# EAGLE design 8 Cell Balancing Module (EAGLE 5.12)
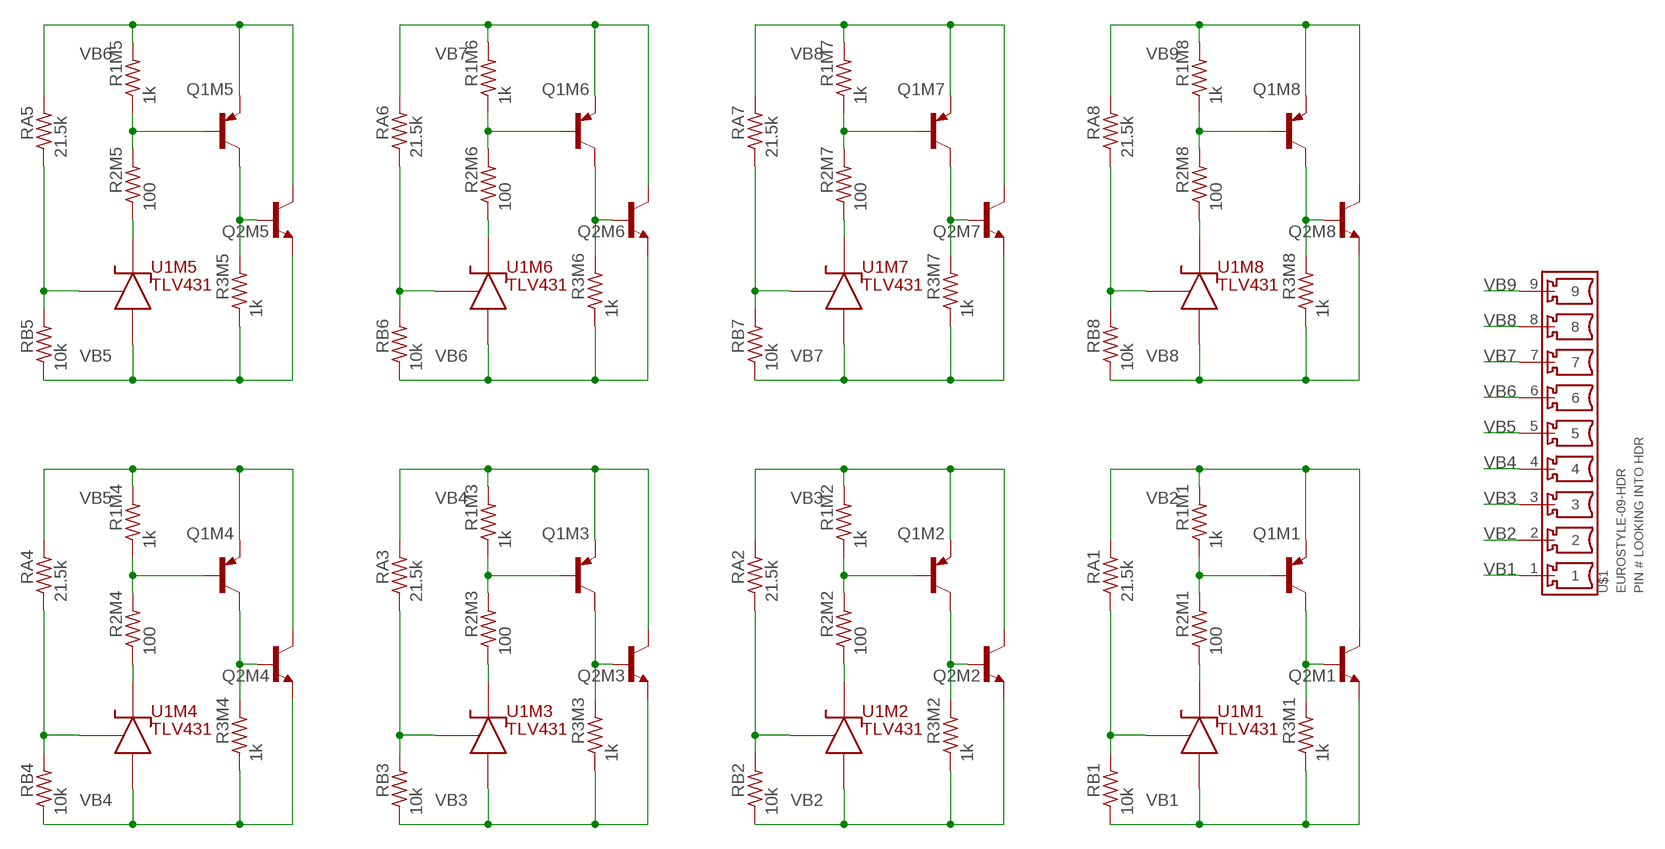
[diagram p0: schematic, sheet 1]

## Parts
Q1M1  MMBT3906LT1SMD  [SOT23-BEC]
Q1M2  MMBT3906LT1SMD  [SOT23-BEC]
Q1M3  MMBT3906LT1SMD  [SOT23-BEC]
Q1M4  MMBT3906LT1SMD  [SOT23-BEC]
Q1M5  MMBT3906LT1SMD  [SOT23-BEC]
Q1M6  MMBT3906LT1SMD  [SOT23-BEC]
Q1M7  MMBT3906LT1SMD  [SOT23-BEC]
Q1M8  MMBT3906LT1SMD  [SOT23-BEC]
Q2M1  D44VH10  -NPN-TO220V  [TO220V]
Q2M2  D44VH10  -NPN-TO220V  [TO220V]
Q2M3  D44VH10  -NPN-TO220V  [TO220V]
Q2M4  D44VH10  -NPN-TO220V  [TO220V]
Q2M5  D44VH10  -NPN-TO220V  [TO220V]
Q2M6  D44VH10  -NPN-TO220V  [TO220V]
Q2M7  D44VH10  -NPN-TO220V  [TO220V]
Q2M8  D44VH10  -NPN-TO220V  [TO220V]
R1M1  1k  R-US_R0603  [R0603]
R1M2  1k  R-US_R0603  [R0603]
R1M3  1k  R-US_R0603  [R0603]
R1M4  1k  R-US_R0603  [R0603]
R1M5  1k  R-US_R0603  [R0603]
R1M6  1k  R-US_R0603  [R0603]
R1M7  1k  R-US_R0603  [R0603]
R1M8  1k  R-US_R0603  [R0603]
R2M1  100  R-US_R0603  [R0603]
R2M2  100  R-US_R0603  [R0603]
R2M3  100  R-US_R0603  [R0603]
R2M4  100  R-US_R0603  [R0603]
R2M5  100  R-US_R0603  [R0603]
R2M6  100  R-US_R0603  [R0603]
R2M7  100  R-US_R0603  [R0603]
R2M8  100  R-US_R0603  [R0603]
R3M1  1k  R-US_R0603  [R0603]
R3M2  1k  R-US_R0603  [R0603]
R3M3  1k  R-US_R0603  [R0603]
R3M4  1k  R-US_R0603  [R0603]
R3M5  1k  R-US_R0603  [R0603]
R3M6  1k  R-US_R0603  [R0603]
R3M7  1k  R-US_R0603  [R0603]
R3M8  1k  R-US_R0603  [R0603]
RA1  21.5k  R-US_R0603  [R0603]
RA2  21.5k  R-US_R0603  [R0603]
RA3  21.5k  R-US_R0603  [R0603]
RA4  21.5k  R-US_R0603  [R0603]
RA5  21.5k  R-US_R0603  [R0603]
RA6  21.5k  R-US_R0603  [R0603]
RA7  21.5k  R-US_R0603  [R0603]
RA8  21.5k  R-US_R0603  [R0603]
RB1  10k  R-US_R0603  [R0603]
RB2  10k  R-US_R0603  [R0603]
RB3  10k  R-US_R0603  [R0603]
RB4  10k  R-US_R0603  [R0603]
RB5  10k  R-US_R0603  [R0603]
RB6  10k  R-US_R0603  [R0603]
RB7  10k  R-US_R0603  [R0603]
RB8  10k  R-US_R0603  [R0603]
U1M1  TLV431  [SOT-23-5_(DBV-R-PDSO-G5)]
U1M2  TLV431  [SOT-23-5_(DBV-R-PDSO-G5)]
U1M3  TLV431  [SOT-23-5_(DBV-R-PDSO-G5)]
U1M4  TLV431  [SOT-23-5_(DBV-R-PDSO-G5)]
U1M5  TLV431  [SOT-23-5_(DBV-R-PDSO-G5)]
U1M6  TLV431  [SOT-23-5_(DBV-R-PDSO-G5)]
U1M7  TLV431  [SOT-23-5_(DBV-R-PDSO-G5)]
U1M8  TLV431  [SOT-23-5_(DBV-R-PDSO-G5)]
U$1  EUROSTYLE-09-HDR  [EUROSTYLE_HEADER-9CKT-RA]

## Nets
N$1: Q1M1.C Q2M1.1(B) R3M1.2
N$2: Q1M1.B R1M1.1 R2M1.2
N$3: RA2.1 RB2.2 U1M2.4(P$2.REF)
N$4: R2M2.1 U1M2.3(P$1.CATHODE)
N$5: Q1M2.C Q2M2.1(B) R3M2.2
N$6: Q1M2.B R1M2.1 R2M2.2
N$7: RA3.1 RB3.2 U1M3.4(P$2.REF)
N$8: R2M3.1 U1M3.3(P$1.CATHODE)
N$9: Q1M3.C Q2M3.1(B) R3M3.2
N$10: Q1M3.B R1M3.1 R2M3.2
N$11: RA4.1 RB4.2 U1M4.4(P$2.REF)
N$12: R2M4.1 U1M4.3(P$1.CATHODE)
N$13: Q1M4.C Q2M4.1(B) R3M4.2
N$14: Q1M4.B R1M4.1 R2M4.2
N$15: RA5.1 RB5.2 U1M5.4(P$2.REF)
N$16: R2M5.1 U1M5.3(P$1.CATHODE)
N$17: Q1M5.C Q2M5.1(B) R3M5.2
N$18: Q1M5.B R1M5.1 R2M5.2
N$19: RA6.1 RB6.2 U1M6.4(P$2.REF)
N$20: R2M6.1 U1M6.3(P$1.CATHODE)
N$21: Q1M6.C Q2M6.1(B) R3M6.2
N$22: Q1M6.B R1M6.1 R2M6.2
N$23: RA7.1 RB7.2 U1M7.4(P$2.REF)
N$24: R2M7.1 U1M7.3(P$1.CATHODE)
N$25: Q1M7.C Q2M7.1(B) R3M7.2
N$26: Q1M7.B R1M7.1 R2M7.2
N$27: RA8.1 RB8.2 U1M8.4(P$2.REF)
N$28: R2M8.1 U1M8.3(P$1.CATHODE)
N$29: Q1M8.C Q2M8.1(B) R3M8.2
N$30: Q1M8.B R1M8.1 R2M8.2
N$50: RA1.1 RB1.2 U1M1.4(P$2.REF)
N$56: R2M1.1 U1M1.3(P$1.CATHODE)
VB1: Q2M1.3(E) R3M1.1 RB1.1 U1M1.5(P$3.ANODE) U$1.1
VB2: Q1M1.E Q2M1.2(C) Q2M2.3(E) R1M1.2 R3M2.1 RA1.2 RB2.1 U1M2.5(P$3.ANODE) U$1.2
VB3: Q1M2.E Q2M2.2(C) Q2M3.3(E) R1M2.2 R3M3.1 RA2.2 RB3.1 U1M3.5(P$3.ANODE) U$1.3
VB4: Q1M3.E Q2M3.2(C) Q2M4.3(E) R1M3.2 R3M4.1 RA3.2 RB4.1 U1M4.5(P$3.ANODE) U$1.4
VB5: Q1M4.E Q2M4.2(C) Q2M5.3(E) R1M4.2 R3M5.1 RA4.2 RB5.1 U1M5.5(P$3.ANODE) U$1.5
VB6: Q1M5.E Q2M5.2(C) Q2M6.3(E) R1M5.2 R3M6.1 RA5.2 RB6.1 U1M6.5(P$3.ANODE) U$1.6
VB7: Q1M6.E Q2M6.2(C) Q2M7.3(E) R1M6.2 R3M7.1 RA6.2 RB7.1 U1M7.5(P$3.ANODE) U$1.7
VB8: Q1M7.E Q2M7.2(C) Q2M8.3(E) R1M7.2 R3M8.1 RA7.2 RB8.1 U1M8.5(P$3.ANODE) U$1.8
VB9: Q1M8.E Q2M8.2(C) R1M8.2 RA8.2 U$1.9

## Library data of the parts
Q1M1-Q1M8 = transistor-pnp:MMBT3906*: PNP Transistror
Q2M1-Q2M8 = transistor:*-NPN-: NPN Transistror BF959 corrected 2008.03.06
R1M1-R1M8 R2M1-R2M8 R3M1-R3M8 RA1-RA8 RB1-RB8 = resistor:R-US_: RESISTOR, American symbol
U1M1-U1M8 = TI:TLV431: TLV431 Low-Voltage Adjustable Precision Shunt Regulator
U$1 = Molex:EUROSTYLE-09-HDR

## Board
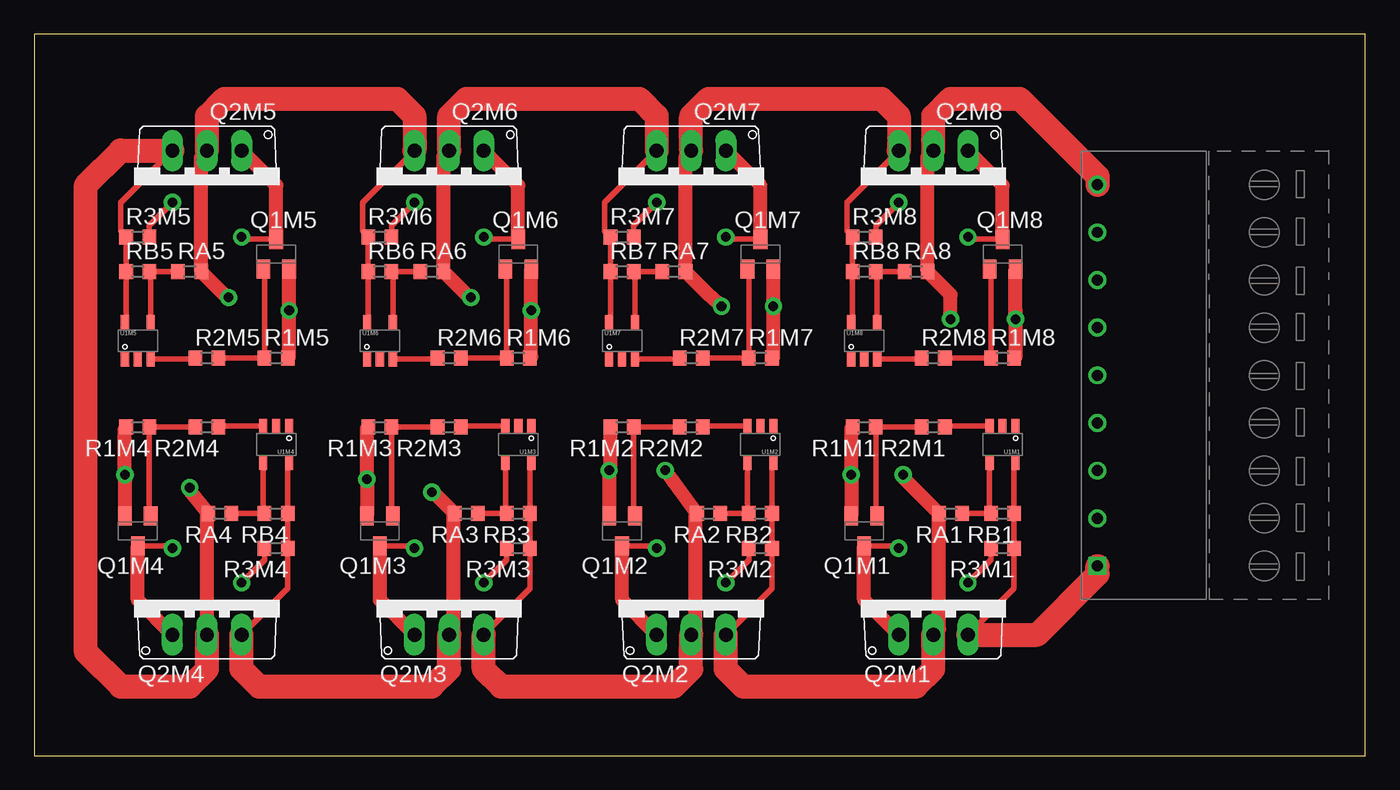
[diagram p1: board, top side]
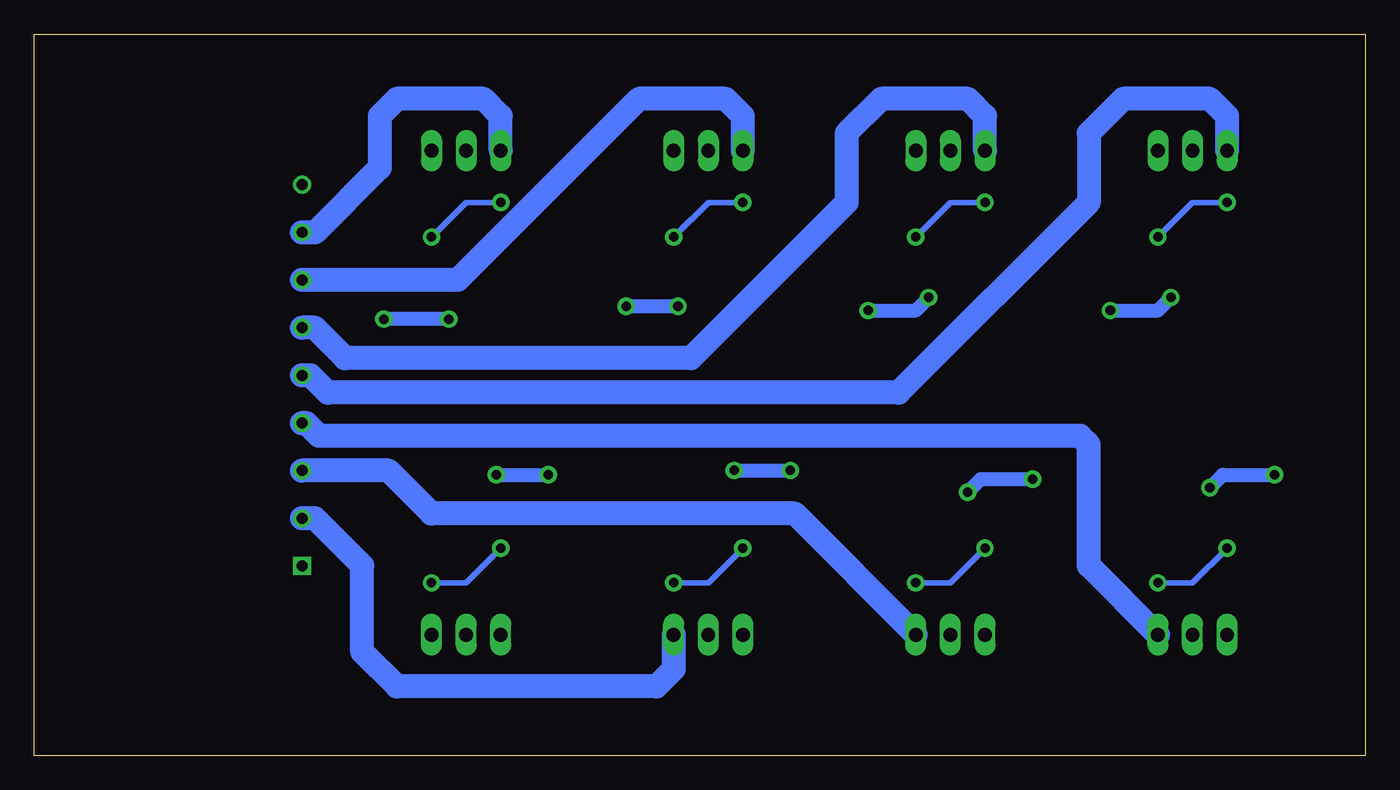
[diagram p2: board, bottom side, seen from below]

Size 97.77 x 53.01 mm. Coordinates in mm from the lower left corner, seen from the top.
Outline: 0,0 97.77,0 97.77,53.01 0,53.01 0,0
Copper layers (1*16): Top 0.035mm / dielectric 1.5mm / Bottom 0.035mm
Design rules "default": minimum track width 10mil, minimum drill 24mil, track to track 8mil, track to pad 8mil, pad to pad 8mil, via to via 8mil, smd to smd 8mil, copper to edge 40mil, drill to drill 8mil, minimum pad ring 10mil, minimum via ring 8mil, stop-mask expansion 4mil, vias tented up to drill 0mil, thermal gap 10mil

### Footprints (pad centres in the part's own frame; a part is rotated, then mirrored left to right if it is on the bottom)
SOT23-BEC = smd 1 x 1.4: B -0.95,-1.1; C 0,1.1; E 0.95,-1.1
TO220V = drill 1.016 long: 1 -2.54,-2.54; 2 0,-2.54; 3 2.54,-2.54
R0603 = smd 1 x 1.1: 1 -0.85,0; 2 0.85,0
SOT-23-5_(DBV-R-PDSO-G5) = smd 0.6 x 1.05: 1 -0.95,-1.35; 2 0,-1.35; 3 0.95,-1.35; 4 0.95,1.35; 5 -0.95,1.35
EUROSTYLE_HEADER-9CKT-RA = drill 0.8 pad 1.22 square: 1 -14,7 | drill 0.8 pad 1.22 round: 2 -10.5,7; 3 -7,7; 4 -3.5,7; 5 0,7; 6 3.5,7; 7 7,7; 8 10.5,7; 9 14,7

### Placement (x,y rotation side)
Q1M1  60.96,16.51 180 top
Q1M2  43.18,16.51 180 top
Q1M3  25.4,16.51 180 top
Q1M4  7.62,16.51 180 top
Q1M5  17.78,36.83 0 top
Q1M6  35.56,36.83 0 top
Q1M7  53.34,36.83 0 top
Q1M8  71.12,36.83 0 top
Q2M1  66.04,11.43 0 top
Q2M2  48.26,11.43 0 top
Q2M3  30.48,11.43 0 top
Q2M4  12.7,11.43 0 top
Q2M5  12.7,41.91 180 top
Q2M6  30.48,41.91 180 top
Q2M7  48.26,41.91 180 top
Q2M8  66.04,41.91 180 top
R1M1  60.96,24.13 180 top
R1M2  43.18,24.13 180 top
R1M3  25.4,24.13 180 top
R1M4  7.62,24.13 180 top
R1M5  17.78,29.21 0 top
R1M6  35.56,29.21 0 top
R1M7  53.34,29.21 0 top
R1M8  71.12,29.21 0 top
R2M1  66.04,24.13 180 top
R2M2  48.26,24.13 180 top
R2M3  30.48,24.13 180 top
R2M4  12.7,24.13 180 top
R2M5  12.7,29.21 0 top
R2M6  30.48,29.21 0 top
R2M7  48.26,29.21 0 top
R2M8  66.04,29.21 0 top
R3M1  71.12,15.24 180 top
R3M2  53.34,15.24 180 top
R3M3  35.56,15.24 180 top
R3M4  17.78,15.24 180 top
R3M5  7.62,38.1 0 top
R3M6  25.4,38.1 0 top
R3M7  43.18,38.1 0 top
R3M8  60.96,38.1 0 top
RA1  67.31,17.78 180 top
RA2  49.53,17.78 180 top
RA3  31.75,17.78 180 top
RA4  13.65,17.78 180 top
RA5  11.43,35.56 0 top
RA6  29.21,35.56 0 top
RA7  46.99,35.56 0 top
RA8  64.77,35.56 0 top
RB1  71.12,17.78 180 top
RB2  53.34,17.78 180 top
RB3  35.56,17.78 180 top
RB4  17.78,17.78 180 top
RB5  7.62,35.56 0 top
RB6  25.4,35.56 0 top
RB7  43.18,35.56 0 top
RB8  60.96,35.56 0 top
U1M1  71.12,22.86 180 top
U1M2  53.34,22.86 180 top
U1M3  35.56,22.86 180 top
U1M4  17.78,22.86 180 top
U1M5  7.62,30.48 0 top
U1M6  25.4,30.48 0 top
U1M7  43.18,30.48 0 top
U1M8  60.96,30.48 0 top
U$1  85.09,27.94 90 top

### Tracks (layer width: path | path; a pad name or v marks a point on that pad's centre or on a via)
N$1  (via drill 0.7 pad 1.27)
  Top 0.406: R3M1.2 70.27,14.39 v68.58,12.7 | v63.5,15.24 63.33,15.41 Q1M1.C
  Top 1.016: Q2M1.1 60.96,11.43 Q1M1.C
  Bottom 0.406: v68.58,12.7 66.04,12.7 v63.5,15.24
N$2
  Top 0.406: R1M1.1 R2M1.2 | R1M1.1 61.91,24.13 | Q1M1.B 61.81,17.71 R1M1.1
N$3
  Top 0.406: U1M2.4 52.39,17.78 RB2.2 RA2.1
N$4
  Top 0.406: U1M2.3 49.11,24.21 R2M2.1
N$5  (via drill 0.7 pad 1.27)
  Top 0.406: R3M2.2 52.49,14.39 v50.8,12.7 | v45.72,15.24 45.55,15.41 Q1M2.C
  Top 1.016: Q2M2.1 43.18,11.43 Q1M2.C
  Bottom 0.406: v50.8,12.7 48.26,12.7 v45.72,15.24
N$6
  Top 0.406: R1M2.1 R2M2.2 | R1M2.1 44.13,24.13 | Q1M2.B 44.03,17.71 R1M2.1
N$7
  Top 0.406: U1M3.4 34.61,17.78 RB3.2 RA3.1
N$8
  Top 0.406: U1M3.3 31.33,24.21 R2M3.1
N$9  (via drill 0.7 pad 1.27)
  Top 0.406: R3M3.2 34.71,14.39 v33.02,12.7 | v27.94,15.24 27.77,15.41 Q1M3.C
  Top 1.016: Q2M3.1 25.4,11.43 Q1M3.C
  Bottom 0.406: v33.02,12.7 30.48,12.7 v27.94,15.24
N$10
  Top 0.406: R1M3.1 R2M3.2 | R1M3.1 26.35,24.13 | Q1M3.B 26.25,17.71 R1M3.1
N$11
  Top 0.406: U1M4.4 16.83,17.78 RB4.2 RA4.1
N$12
  Top 0.406: U1M4.3 13.55,24.21 R2M4.1
N$13  (via drill 0.7 pad 1.27)
  Top 0.406: R3M4.2 16.93,14.39 v15.24,12.7 | v10.16,15.24 9.99,15.41 Q1M4.C
  Top 1.016: Q2M4.1 7.62,11.43 Q1M4.C
  Bottom 0.406: v15.24,12.7 12.7,12.7 v10.16,15.24
N$14
  Top 0.406: R1M4.1 R2M4.2 | R1M4.1 8.57,24.13 | Q1M4.B 8.47,17.71 R1M4.1
N$15
  Top 0.406: U1M5.4 8.57,35.56 RB5.2 RA5.1
N$16
  Top 0.406: U1M5.3 11.85,29.13 R2M5.1
N$17  (via drill 0.7 pad 1.27)
  Top 0.406: R3M5.2 8.47,38.95 v10.16,40.64 | v15.24,38.1 15.41,37.93 Q1M5.C
  Top 1.016: Q2M5.1 17.78,41.91 Q1M5.C
  Bottom 0.406: v10.16,40.64 12.7,40.64 v15.24,38.1
N$18
  Top 0.406: R2M5.2 R1M5.1 | R1M5.1 16.83,29.21 | Q1M5.B 16.93,35.63 R1M5.1
N$19
  Top 0.406: U1M6.4 26.35,35.56 RB6.2 RA6.1
N$20
  Top 0.406: U1M6.3 29.63,29.13 R2M6.1
N$21  (via drill 0.7 pad 1.27)
  Top 0.406: R3M6.2 26.25,38.95 v27.94,40.64 | v33.02,38.1 33.19,37.93 Q1M6.C
  Top 1.016: Q2M6.1 35.56,41.91 Q1M6.C
  Bottom 0.406: v27.94,40.64 30.48,40.64 v33.02,38.1
N$22
  Top 0.406: R2M6.2 R1M6.1 | R1M6.1 34.61,29.21 | Q1M6.B 34.71,35.63 R1M6.1
N$23
  Top 0.406: U1M7.4 44.13,35.56 RB7.2 RA7.1
N$24
  Top 0.406: U1M7.3 47.41,29.13 R2M7.1
N$25  (via drill 0.7 pad 1.27)
  Top 0.406: R3M7.2 44.03,38.95 v45.72,40.64 | v50.8,38.1 50.97,37.93 Q1M7.C
  Top 1.016: Q2M7.1 53.34,41.91 Q1M7.C
  Bottom 0.406: v45.72,40.64 48.26,40.64 v50.8,38.1
N$26
  Top 0.406: R2M7.2 R1M7.1 | R1M7.1 52.39,29.21 | Q1M7.B 52.49,35.63 R1M7.1
N$27
  Top 0.406: U1M8.4 61.91,35.56 RB8.2 RA8.1
N$28
  Top 0.406: U1M8.3 65.19,29.13 R2M8.1
N$29  (via drill 0.7 pad 1.27)
  Top 0.406: R3M8.2 61.81,38.95 v63.5,40.64 | v68.58,38.1 68.75,37.93 Q1M8.C
  Top 1.016: Q2M8.1 71.12,41.91 Q1M8.C
  Bottom 0.406: v63.5,40.64 66.04,40.64 v68.58,38.1
N$30
  Top 0.406: R2M8.2 R1M8.1 | R1M8.1 70.17,29.21 | Q1M8.B 70.27,35.63 R1M8.1
N$50
  Top 0.406: U1M1.4 70.17,17.78 RB1.2 RA1.1
N$56
  Top 0.406: U1M1.3 66.89,24.21 R2M1.1
VB1
  Top 0.406: U1M1.5 71.97,21.51 RB1.1 R3M1.1 71.97,12.28 Q2M1.3
  Top 1.778: U$1.1 78.09,13.32 73.66,8.89 Q2M1.3
VB2  (via drill 0.7 pad 1.27)
  Top 0.406: U1M2.5 54.19,21.51 RB2.1 R3M2.1 54.19,12.28 Q2M2.3
  Top 1.016: Q2M1.2 66.46,9.31 RA1.2 63.92,20.32 v63.82,20.64 | 60.01,20.32 Q1M1.E | v60.01,20.64 60.01,20.32 | 60.01,20.32 60.01,24.03 R1M1.2
  Top 1.778: Q2M1.2 66.04,6.35 64.77,5.08 52.07,5.08 50.8,6.35 Q2M2.3
  Bottom 1.016: v63.82,20.64 v60.01,20.64
  Bottom 1.778: U$1.2 77.13,17.44 73.66,13.97 73.66,7.62 71.12,5.08 52.07,5.08 50.8,6.35 Q2M2.3
VB3  (via drill 0.7 pad 1.27)
  Top 0.406: U1M3.5 36.41,21.51 RB3.1 R3M3.1 36.41,12.28 Q2M3.3
  Top 1.016: Q1M2.E v42.23,20.95 42.33,21.06 R1M2.2 | v46.35,20.95 46.99,20.11 RA2.2 48.58,17.68 48.58,9.21 Q2M2.2
  Top 1.778: Q2M2.2 48.26,6.35 46.99,5.08 34.29,5.08 33.02,6.35 Q2M3.3
  Bottom 1.016: v46.35,20.95 v42.23,20.95
  Bottom 1.778: U$1.3 71.74,20.94 68.58,17.78 41.91,17.78 Q2M3.3
VB4  (via drill 0.7 pad 1.27)
  Top 0.406: U1M4.5 18.63,21.51 RB4.1 R3M4.1 18.63,12.28 Q2M4.3
  Top 1.016: Q1M3.E v24.45,20.32 24.45,24.03 R1M3.2 | v29.21,19.37 29.31,19.37 RA3.2 30.8,17.68 30.8,9.21 Q2M3.2
  Top 1.778: Q2M3.2 30.48,6.35 29.21,5.08 16.51,5.08 15.24,6.35 Q2M4.3
  Bottom 1.016: v24.45,20.32 28.26,20.32 v29.21,19.37
  Bottom 1.778: Q2M4.3 20.32,13.97 20.32,22.86 20.95,23.5 76.83,23.5 77.78,24.44 U$1.4
VB5  (via drill 0.7 pad 1.27)
  Top 0.406: U1M5.5 6.77,31.83 RB5.1 R3M5.1 6.35,38.52 6.35,40.64 Q2M5.3
  Top 1.016: Q1M4.E v6.67,20.64 6.67,24.03 R1M4.2 | v11.43,19.68 11.43,19.47 RA4.2 12.7,17.68 Q2M4.2
  Top 1.778: Q2M4.2 12.7,6.35 11.43,5.08 6.35,5.08 3.81,7.62 3.81,41.91 6.35,44.45 Q2M5.3
  Bottom 1.016: v6.67,20.64 10.48,20.64 v11.43,19.68
  Bottom 1.778: U$1.5 77.47,27.94 76.2,26.67 34.29,26.67 20.32,40.64 20.32,45.72 17.78,48.26 11.43,48.26 10.16,46.99 Q2M5.3
VB6  (via drill 0.7 pad 1.27)
  Top 0.406: U1M6.5 24.55,31.83 RB6.1 R3M6.1 24.13,38.52 24.13,40.64 Q2M6.3
  Top 1.016: Q2M5.2 12.28,44.03 RA5.2 14.19,33.66 v14.29,33.66 | v18.73,32.7 Q1M5.E | v18.73,32.7 | v18.73,32.7 18.73,29.31 R1M5.2
  Top 1.778: Q2M5.2 12.7,46.99 13.97,48.26 26.67,48.26 27.94,46.99 Q2M6.3
  Bottom 1.016: v18.73,32.7 15.24,32.7 v14.29,33.66
  Bottom 1.778: U$1.6 77.16,31.44 74.93,29.21 49.53,29.21 38.1,40.64 38.1,45.72 35.56,48.26 29.21,48.26 27.94,46.99 Q2M6.3
VB7  (via drill 0.7 pad 1.27)
  Top 0.406: U1M7.5 42.33,31.83 RB7.1 R3M7.1 41.91,38.52 41.91,40.64 Q2M7.3
  Top 1.016: Q2M6.2 30.06,44.03 RA6.2 31.96,33.66 v32.07,33.66 | v36.51,32.7 Q1M6.E | v36.51,32.7 | v36.51,32.7 36.51,29.31 R1M6.2
  Top 1.778: Q2M6.2 30.48,46.99 31.75,48.26 44.45,48.26 45.72,46.99 Q2M7.3
  Bottom 1.016: v36.51,32.7 33.02,32.7 v32.07,33.66
  Bottom 1.778: U$1.7 66.66,34.94 53.34,48.26 46.99,48.26 45.72,46.99 Q2M7.3
VB8  (via drill 0.7 pad 1.27)
  Top 0.406: U1M8.5 60.11,31.83 RB8.1 R3M8.1 59.69,38.52 59.69,40.64 Q2M8.3
  Top 1.016: Q2M7.2 47.84,44.03 RA7.2 49.53,33.87 v50.48,33.02 | v54.29,33.02 Q1M7.E | v54.29,33.02 | v54.29,33.02 54.29,29.31 R1M7.2
  Top 1.778: Q2M7.2 48.26,46.99 49.53,48.26 62.23,48.26 63.5,46.99 Q2M8.3
  Bottom 1.016: v54.29,33.02 v50.48,33.02
  Bottom 1.778: U$1.8 77.13,38.44 72.39,43.18 72.39,46.99 71.12,48.26 64.77,48.26 63.5,46.99 Q2M8.3
VB9  (via drill 0.7 pad 1.27)
  Top 1.016: Q2M8.2 65.62,44.03 RA8.2 67.31,33.87 v67.31,32.07 | 72.07,32.7 Q1M8.E | v72.07,32.07 72.07,32.7 | 72.07,32.7 72.07,29.31 R1M8.2
  Top 1.778: U$1.9 78.09,42.56 72.39,48.26 67.31,48.26 66.04,46.99 Q2M8.2
  Bottom 1.016: v67.31,32.07 v72.07,32.07